# Altium schematic sheet 6.音频_FAN_ADC_LED.SchDoc
size 420 x 297 mm; SheetNumber: 6; SheetTotal: 13
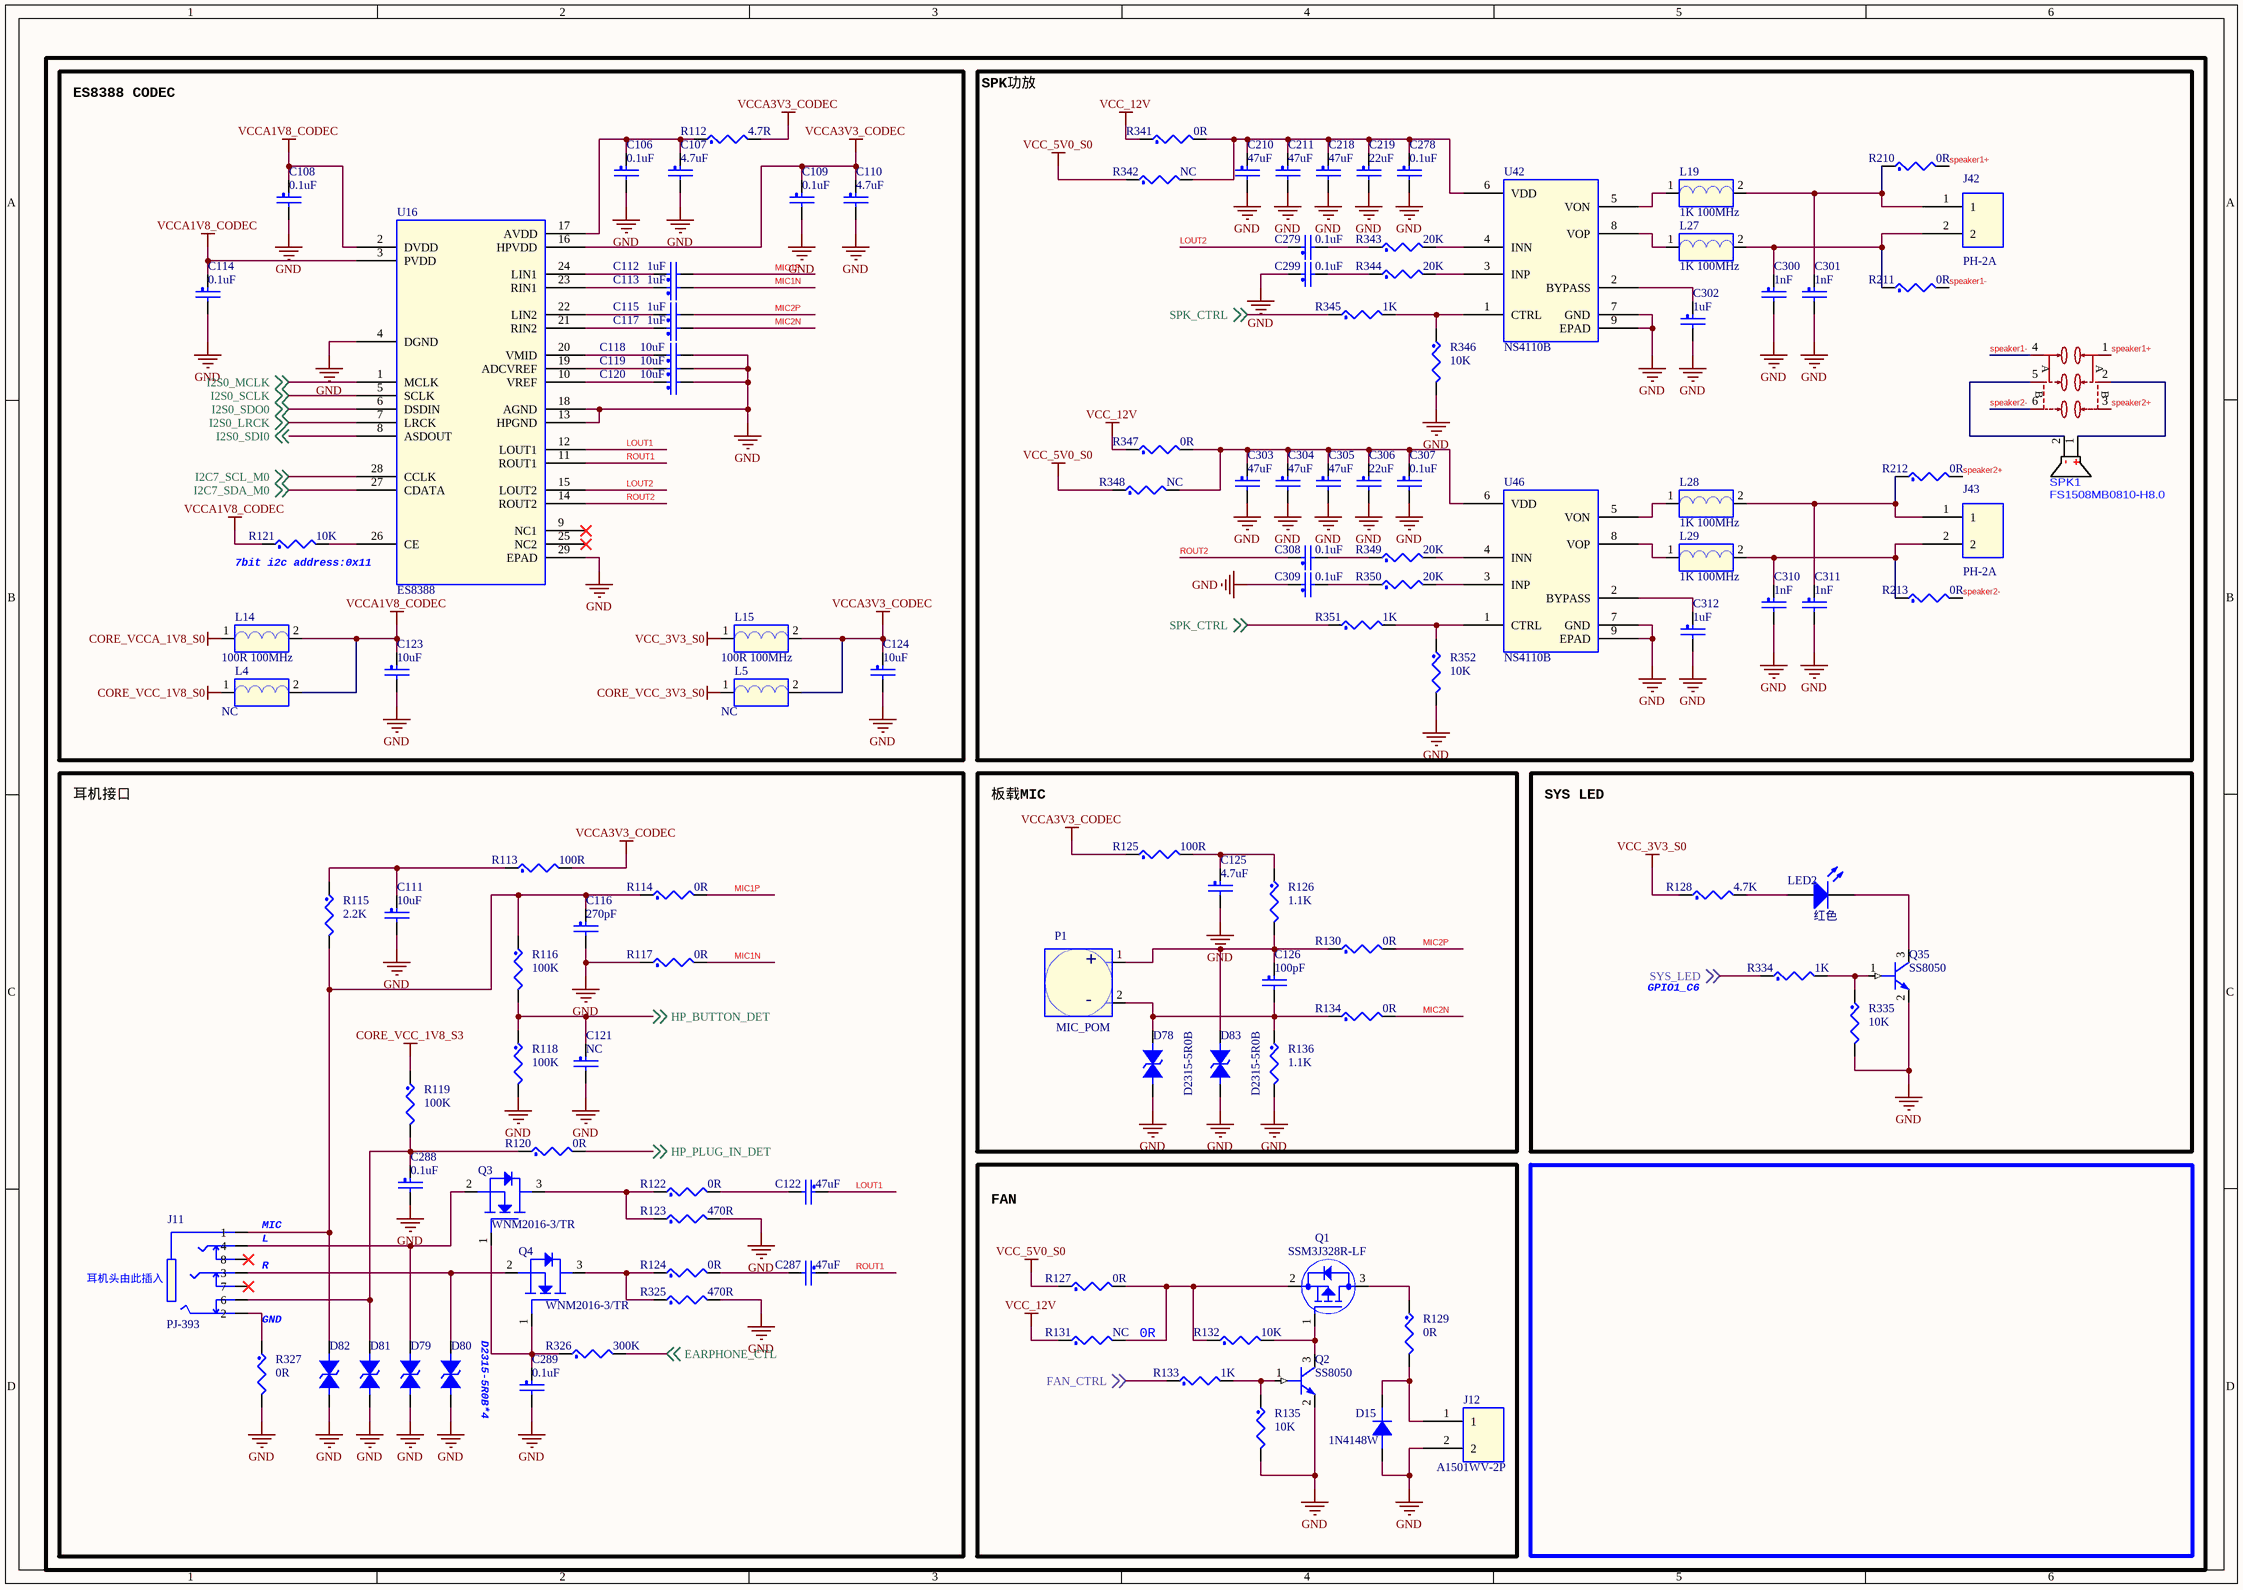
[diagram p0: 6.音频_FAN_ADC_LED.SchDoc]

## Parts
C106  0.1uF  [C0402]
C107  4.7uF  [C0402]
C108  0.1uF  [C0402]
C109  0.1uF  [C0402]
C110  4.7uF  [C0402]
C111  10uF  [C0402]
C112  1uF  [C0402]
C113  1uF  [C0402]
C114  0.1uF  [C0402]
C115  1uF  [C0402]
C116  270pF  [C0402]
C117  1uF  [C0402]
C118  10uF  [C0402]
C119  10uF  [C0402]
C120  10uF  [C0402]
C121  NC  [C0402]
C122  47uF  [C0603]
C123  10uF  [C0402]
C124  10uF  [C0402]
C125  4.7uF  [C0402]
C126  100pF  [C0402]
C210  47uF  [C1206]
C211  47uF  [C1206]
C218  47uF  [C1206]
C219  22uF  [C0805]
C278  0.1uF  [C0402]
C279  0.1uF  [C0402]
C287  47uF  [C0603]
C288  0.1uF  [C0402]
C289  0.1uF  [C0402]
C299  0.1uF  [C0402]
C300  1nF  [C0402]
C301  1nF  [C0402]
C302  1uF  [C0402]
C303  47uF  [C1206]
C304  47uF  [C1206]
C305  47uF  [C1206]
C306  22uF  [C0805]
C307  0.1uF  [C0402]
C308  0.1uF  [C0402]
C309  0.1uF  [C0402]
C310  1nF  [C0402]
C311  1nF  [C0402]
C312  1uF  [C0402]
D15  1N4148W  [SOD-123]
D78  D2315-5R0B  [esd0402]
D79  D2315-5R0B  [esd0402]  (value not drawn)
D80  D2315-5R0B  [esd0402]  (value not drawn)
D81  D2315-5R0B  [esd0402]  (value not drawn)
D82  D2315-5R0B  [esd0402]  (value not drawn)
D83  D2315-5R0B  [esd0402]
J11  PJ-393  [audio_smd_7p_6r0x8r8]
J12  A1501WV-2P  [zh1p5mm_th_2p]
J42  PH-2A  [PH-1x2-2P0_l]
J43  PH-2A  [PH-1x2-2P0_l]
L4  NC  [L0603]
L5  NC  [L0603]
L14  100R 100MHz  [L0603]
L15  100R 100MHz  [L0603]
L19  1K 100MHz  [L0603]
L27  1K 100MHz  [L0603]
L28  1K 100MHz  [L0603]
L29  1K 100MHz  [L0603]
LED2  红色  [LED0603_R]
P1  MIC_POM  [MIC2-4R00-TM]
Q1  SSM3J328R-LF  [SOT23]
Q2  SS8050  [SOT23]
Q3  WNM2016-3/TR  [SOT23]
Q4  WNM2016-3/TR  [SOT23]
Q35  SS8050  [SOT23]
R112  4.7R  [R0402]
R113  100R  [R0402]
R114  0R  [R0402]
R115  2.2K  [R0402]
R116  100K  [R0402]
R117  0R  [R0402]
R118  100K  [R0402]
R119  100K  [R0402]
R120  0R  [R0402]
R121  10K  [R0402]
R122  0R  [R0402]
R123  470R  [R0402]
R124  0R  [R0402]
R125  100R  [R0402]
R126  1.1K  [R0402]
R127  0R  [R0805]
R128  4.7K  [R0402]
R129  0R  [R0805]
R130  0R  [R0402]
R131  NC  [R0805]
R132  10K  [R0402]
R133  1K  [R0402]
R134  0R  [R0402]
R135  10K  [R0402]
R136  1.1K  [R0402]
R210  0R  [R0805]
R211  0R  [R0805]
R212  0R  [R0805]
R213  0R  [R0805]
R325  470R  [R0402]
R326  300K  [R0402]
R327  0R  [R0402]
R334  1K  [R0402]
R335  10K  [R0402]
R341  0R  [R0603]
R342  NC  [R0603]
R343  20K  [R0402]
R344  20K  [R0402]
R345  1K  [R0402]
R346  10K  [R0402]
R347  0R  [R0603]
R348  NC  [R0603]
R349  20K  [R0402]
R350  20K  [R0402]
R351  1K  [R0402]
R352  10K  [R0402]
SPK1  FS1508MB0810-H8.0  [BEEP-TH_BD15.0-P10.20-D1.2]
SW5  MST22D18G2  [SW-SMD_MST22D18G2]  (value not drawn)
U16  ES8388  [qfn28_0r45-4x4EP2R6X2R6]
U42  NS4110B  [SOP-8-EP-2R5X3R4]
U46  NS4110B  [SOP-8-EP-2R5X3R4]

## Blocks framed on the sheet
ES8388 CODEC: C106-C110 C112-C115 C117-C120 C123 C124 L4 L5 L14 L15 R112 R121 U16
SPK功放: C210 C211 C218 C219 C278 C279 C299-C312 J42 J43 L19 L27-L29 R210-R213 R341-R352 SPK1 SW5 U42 U46
耳机接口: C111 C116 C121 C122 C287-C289 D79-D82 J11 Q3 Q4 R113-R120 R122-R124 R325-R327
板载MIC: C125 C126 D78 D83 P1 R125 R126 R130 R134 R136
SYS LED: LED2 Q35 R128 R334 R335
FAN: D15 J12 Q1 Q2 R127 R129 R131-R133 R135

## Nets
CORE_VCC_1V8_S0: L4.1
CORE_VCC_1V8_S3: R119.1
CORE_VCC_3V3_S0: L5.1
CORE_VCCA_1V8_S0: L14.1
GND: C106.2 C107.2 C108.2 C109.2 C110.2 C111.2 C114.2 C116.2 C118.2 C119.2 C120.2 C121.2 C123.2 C124.2 C125.2 C210.2 C211.2 C218.2 C219.2 C278.2 C288.2 C289.2 C299.1 C300.2 C301.2 C302.2 C303.2 C304.2 C305.2 C306.2 C307.2 C309.1 C310.2 C311.2 C312.2 D15.2(A) D78.1 D79.1 D80.1 D81.1 D82.1 D83.1 J12.2 Q2.2(EMITTER) Q35.2(EMITTER) R117.1 R118.2 R123.2 R135.2 R136.2 R325.2 R327.2 R335.2 R346.2 R352.2 U16.4(DGND) U16.13(HPGND) U16.18(AGND) U16.29(EPAD) U42.7(GND) U42.9(EPAD) U46.7(GND) U46.9(EPAD)
VCC_3V3_S0: L15.1 R128.1
VCC_5V0_S0: R127.1 R342.1 R348.1
VCC_12V: R131.1 R341.1 R347.1
VCCA1V8_CODEC: C108.1 C114.1 C123.1 L4.2 L14.2 R121.1 U16.2(DVDD) U16.3(PVDD)
VCCA3V3_CODEC: C109.1 C110.1 C124.1 L5.2 L15.2 R112.2 R113.2 R125.1 U16.16(HPVDD)
EARPHONE_CTL: R326.2 ; off-sheet EARPHONE_CTL
FAN_CTRL: R133.1 ; off-sheet FAN_CTRL
HP_BUTTON_DET: C121.1 R116.2 R118.1 ; off-sheet HP_BUTTON_DET
HP_PLUG_IN_DET: R120.2 ; off-sheet HP_PLUG_IN_DET
I2C7_SCL_M0: U16.28(CCLK) ; off-sheet I2C7_SCL_M0
I2C7_SDA_M0: U16.27(CDATA) ; off-sheet I2C7_SDA_M0
I2S0_LRCK: U16.7(LRCK) ; off-sheet I2S0_LRCK
I2S0_MCLK: U16.1(MCLK) ; off-sheet I2S0_MCLK
I2S0_SCLK: U16.5(SCLK) ; off-sheet I2S0_SCLK
I2S0_SDI0: U16.8(ASDOUT) ; off-sheet I2S0_SDI0
I2S0_SDO0: U16.6(DSDIN) ; off-sheet I2S0_SDO0
LOUT1: C122.1 U16.12(LOUT1)
LOUT2: C279.1 U16.15(LOUT2)
MIC1N: C113.2 R117.2
MIC1P: C112.2 R114.2
MIC2N: C117.2 R134.2
MIC2P: C115.2 R130.2
ROUT1: C287.1 U16.11(ROUT1)
ROUT2: C308.1 U16.14(ROUT2)
speaker1+: R210.2 SW5.1
speaker1-: R211.2 SW5.4
speaker2+: R212.2 SW5.3
speaker2-: R213.2 SW5.6
SPK_CTRL: R345.1 R351.1 ; off-sheet SPK_CTRL
SYS_LED: R334.1 ; off-sheet SYS_LED
NetC106_1: C106.1 C107.1 R112.1 U16.17(AVDD)
NetC111_1: C111.1 R113.1 R115.1
NetC112_1: C112.1 U16.24(LIN1)
NetC113_1: C113.1 U16.23(RIN1)
NetC115_1: C115.1 U16.22(LIN2)
NetC116_1: C116.1 D82.2 J11.1 R114.1 R115.2 R116.1
NetC117_1: C117.1 U16.21(RIN2)
NetC118_1: C118.1 U16.20(VMID)
NetC119_1: C119.1 U16.19(ADCVREF)
NetC120_1: C120.1 U16.10(VREF)
NetC122_2: C122.2 R122.2
NetC125_1: C125.1 R125.2 R126.1
NetC126_1: C126.1 D83.2 P1.1(Out) R126.2 R130.1
NetC126_2: C126.2 D78.2 P1.2(GND) R134.1 R136.1
NetC210_1: C210.1 C211.1 C218.1 C219.1 C278.1 R341.2 R342.2 U42.6(VDD)
NetC279_2: C279.2 R343.1
NetC287_2: C287.2 R124.2
NetC288_1: C288.1 D81.2 J11.6 R119.2 R120.1
NetC289_1: C289.1 Q3.1(GATE) Q4.1(GATE) R326.1
NetC299_2: C299.2 R344.1
NetC300_1: C300.1 J42.2 L27.2 R211.1
NetC301_1: C301.1 J42.1 L19.2 R210.1
NetC302_1: C302.1 U42.2(BYPASS)
NetC303_1: C303.1 C304.1 C305.1 C306.1 C307.1 R347.2 R348.2 U46.6(VDD)
NetC308_2: C308.2 R349.1
NetC309_2: C309.2 R350.1
NetC310_1: C310.1 J43.2 L29.2 R213.1
NetC311_1: C311.1 J43.1 L28.2 R212.1
NetC312_1: C312.1 U46.2(BYPASS)
NetD15_1: D15.1(K) J12.1 R129.2
NetD79_2: D79.2 J11.4 Q3.2(SOURCE)
NetD80_2: D80.2 J11.3 Q4.2(SOURCE)
NetJ11_2: J11.2 R327.1
NetL19_1: L19.1 U42.5(VON)
NetL27_1: L27.1 U42.8(VOP)
NetL28_1: L28.1 U46.5(VON)
NetL29_1: L29.1 U46.8(VOP)
NetLED2_1: LED2.1(A) R128.2
NetLED2_2: LED2.2(K) Q35.3(COLLECTOR)
NetQ1_1: Q1.1(GATE) Q2.3(COLLECTOR) R132.2
NetQ1_2: Q1.2(SOURCE) R127.2 R131.2 R132.1
NetQ1_3: Q1.3(DRAIN) R129.1
NetQ2_1: Q2.1(BASE) R133.2 R135.1
NetQ3_3: Q3.3(DRAIN) R122.1 R123.1
NetQ4_3: Q4.3(DRAIN) R124.1 R325.1
NetQ35_1: Q35.1(BASE) R334.2 R335.1
NetR121_2: R121.2 U16.26(CE)
NetR343_2: R343.2 U42.4(INN)
NetR344_2: R344.2 U42.3(INP)
NetR345_2: R345.2 R346.1 U42.1(CTRL)
NetR349_2: R349.2 U46.4(INN)
NetR350_2: R350.2 U46.3(INP)
NetR351_2: R351.2 R352.1 U46.1(CTRL)
NetSPK1_1: SPK1.1 SW5.2
NetSPK1_2: SPK1.2 SW5.5

Not connected (* = marked no-connect by the designer): J11 7* 8*; U16 9(NC1)* 25(NC2)*

## Notes on the sheet
- (near R121) 7bit i2c address:0x11
- GPIO1_C6
- (near J11) MIC
- (near J11) R
- (near J11) L
- 耳机头由此插入
- GND
- D2315-5R0B*4
- (near R131) 0R
- (in symbol MIC_POM) +; -
- (in symbol MST22D18G2) A; B

## Library data of the parts
C106-C126 C210 C211 C218 C219 C278 C279 C287-C289 C299-C312 = CAP_NP
D15 = DIODE
D78-D83 = DIODE BI-DIR TRIG
J12 J42 J43 = 1X2PIN
L4 L5 L14 L15 L19 L27-L29 = BEAD
LED2 = LED: 贴片LED
Q1 = MOSFET_P
Q2 Q35 = NPN
Q3 Q4 = MOSFET N
R112-R136 R210-R213 R325-R327 R334 R335 R341-R352 = RES